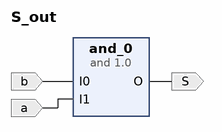
[diagram p0: block diagram of the top level]
# Vivado block design S_out, xc7a35tcpg236-1, Vivado 2018.3
create_bd_design S_out

create_bd_port -dir I -type data b
create_bd_port -dir I -type data a
create_bd_port -dir O -type data S

create_bd_cell -type ip -vlnv FIT:user:and:1.0 and_0
set_property -dict {CONFIG.I0_Inverted true CONFIG.I1_inverted false} [get_bd_cells and_0]

# ---- connections ----

connect_bd_net -net I0_0_1 [get_bd_ports b] [get_bd_pins and_0/I0]
connect_bd_net -net I1_0_1 [get_bd_ports a] [get_bd_pins and_0/I1]
connect_bd_net [get_bd_pins and_0/O] [get_bd_ports S]

validate_bd_design
save_bd_design
